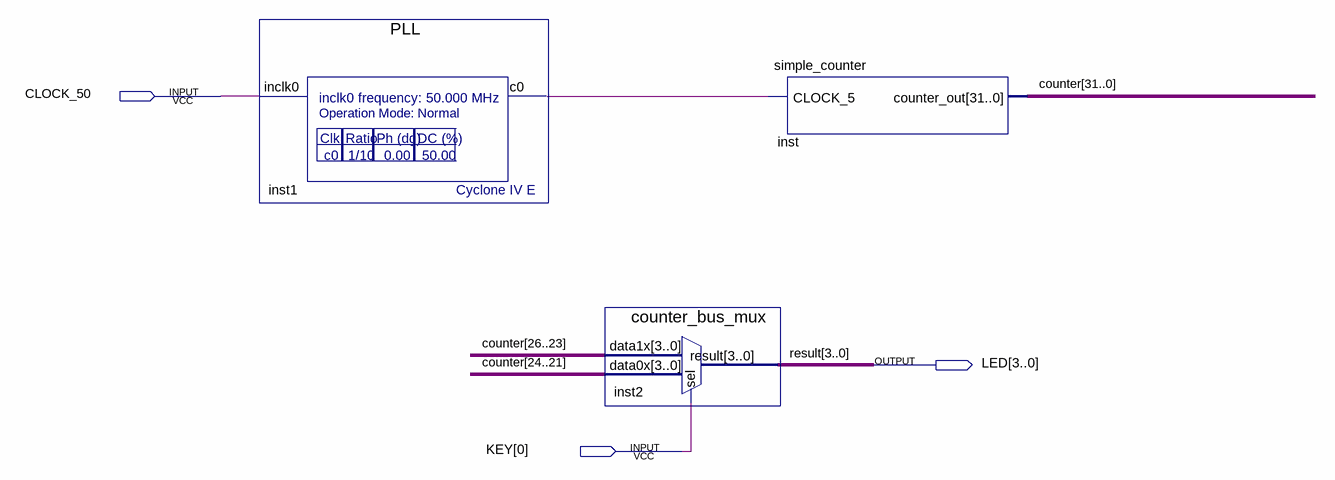
[diagram p0: schematic sheet]
// Quartus schematic Task1.bdf as structural Verilog: 3 symbols, 3 pins
module Task1 (
  input  CLOCK_50,
  input  [0:0] KEY,
  output [3:0] LED
);

  wire inst1_c0;
  wire [31:0] counter;

  PLL inst1 (.inclk0(CLOCK_50), .c0(inst1_c0));
  counter_bus_mux inst2 (.data1x(counter[26:23]), .data0x(counter[24:21]), .sel(KEY[0]), .result(LED));
  simple_counter inst (.CLOCK_5(inst1_c0), .counter_out(counter));

  // Other names for the same wires on the sheet: result[3:0] = LED
endmodule
